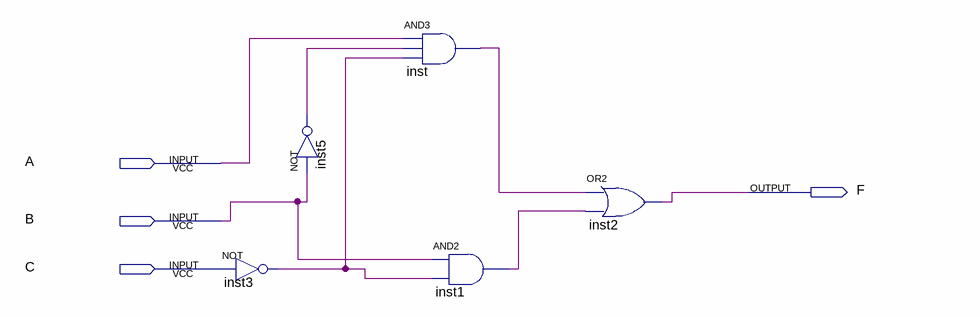
[diagram p0: schematic sheet]
// Quartus schematic lab2step1.bdf as structural Verilog: 5 symbols, 4 pins
module lab2step1 (
  input  A,
  input  B,
  input  C,
  output F
);

  wire inst1_out, inst3_out, inst5_out, inst_out;

  not inst3 (inst3_out, C);
  not inst5 (inst5_out, B);
  and inst (inst_out, A, inst5_out, inst3_out);
  and inst1 (inst1_out, B, inst3_out);
  or inst2 (F, inst_out, inst1_out);
endmodule
